# Altium project PCB_Project_FlightModel_EPS.PrjPcb (part 3 of 4)

## Sheet 3_MCU_EPS.SchDoc: EPS MCU Main
size A3; DrawnBy: Sara V. Martínez; Engineer: Flight; DocumentNumber: 6; Revision: V0.1; SheetNumber: 6; SheetTotal: 11
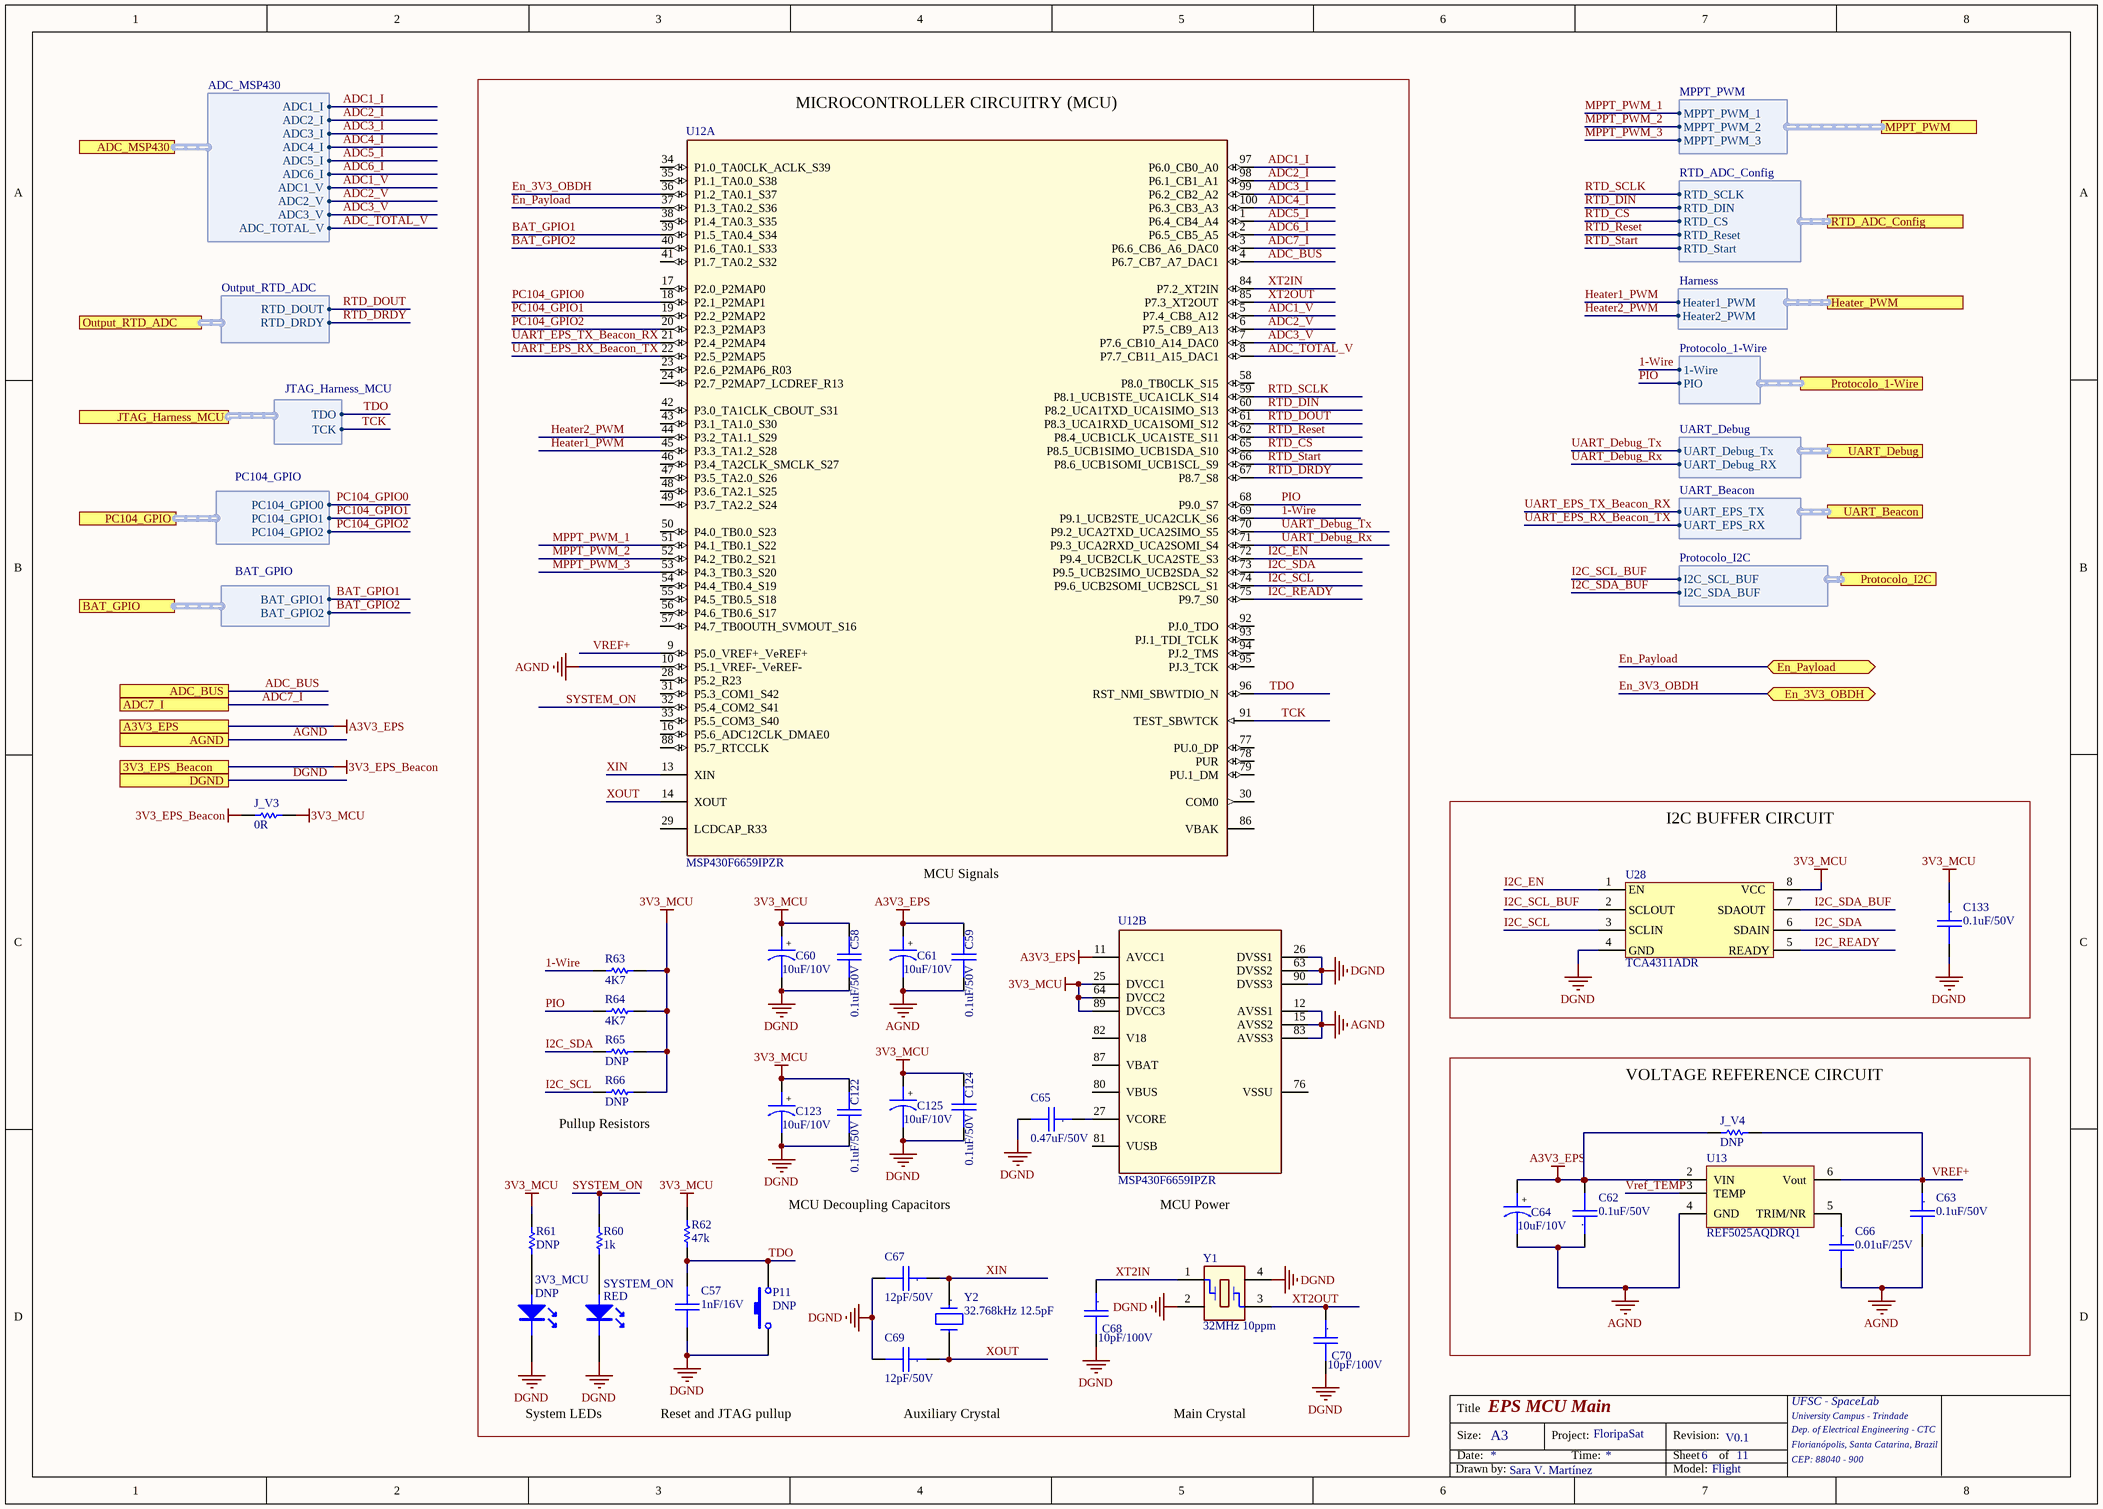
[diagram p4: 3_MCU_EPS.SchDoc]

### Parts
3V3_MCU  DNP  [0603-LED]
C57  1nF/16V  [CC0805]
C58  0.1uF/50V  [CC0603]
C59  0.1uF/50V  [CC0603]
C60  10uF/10V  [CC0805_Tantalum]
C61  10uF/10V  [CC0805_Tantalum]
C62  0.1uF/50V  [CC0805]
C63  0.1uF/50V  [CC0603]
C64  10uF/10V  [CC0805_Tantalum]
C65  0.47uF/50V  [CC0603]
C66  0.01uF/25V  [CC0603]
C67  12pF/50V  [CC0603]
C68  10pF/100V  [CC0805]
C69  12pF/50V  [CC0603]
C70  10pF/100V  [CC0805]
C122  0.1uF/50V  [CC0603]
C123  10uF/10V  [CC0805_Tantalum]
C124  0.1uF/50V  [CC0603]
C125  10uF/10V  [CC0805_Tantalum]
C133  0.1uF/50V  [CC0603]
J_V3  0R  [0805]
J_V4  DNP  [0805]
P11  DNP  [B3U-1000P]
R60  1k  [0603]
R61  DNP  [0603]
R62  47k  [0603]
R63  4K7  [0603]
R64  4K7  [0603]
R65  DNP  [0603]
R66  DNP  [0603]
SYSTEM_ON  RED  [0603-LED]
U12  MSP430F6659IPZR  [PZ0100A_N]  (parts A,B of 2)
U13  REF5025AQDRQ1  [SOIC-8]
U28  TCA4311ADR  [SOIC8]
Y1  32MHz 10ppm  [XTAL_ABM8X]
Y2  32.768kHz 12.5pF  [ABS06 0805]

### Blocks framed on the sheet
MICROCONTROLLER CIRCUITRY (MCU): 3V3_MCU C57-C61 C65 C67-C70 C122-C125 P11 R60-R66 SYSTEM_ON U12 Y1 Y2
I2C BUFFER CIRCUIT: C133 U28
VOLTAGE REFERENCE CIRCUIT: C62-C64 C66 J_V4 U13

### Ports
3V3_EPS_Beacon, A3V3_EPS, ADC7_I, ADC_BUS, ADC_MSP430 (harness ADC_MSP430), AGND, BAT_GPIO (harness BAT_GPIO), DGND, En_3V3_OBDH (bidir), En_Payload (bidir), Heater_PWM (harness Harness), JTAG_Harness_MCU (harness JTAG_Harness_MCU), MPPT_PWM (harness MPPT_PWM), Output_RTD_ADC (harness Output_RTD_ADC), PC104_GPIO (harness PC104_GPIO), Protocolo_1-Wire (harness Protocolo_1-Wire), Protocolo_I2C (harness Protocolo_I2C), RTD_ADC_Config (harness RTD_ADC_Config), UART_Beacon (harness UART_Beacon), UART_Debug (harness UART_Debug)

### Harnesses
ADC_MSP430: ADC1_I, ADC2_I, ADC3_I, ADC1_V, ADC2_V, ADC3_V, ADC_TOTAL_V, ADC4_I, ADC5_I, ADC6_I
MPPT_PWM: MPPT_PWM_1, MPPT_PWM_2, MPPT_PWM_3
Protocolo_1-Wire: 1-Wire, PIO
Output_RTD_ADC: RTD_DOUT, RTD_DRDY
RTD_ADC_Config: RTD_SCLK, RTD_DIN, RTD_CS, RTD_Reset, RTD_Start
JTAG_Harness_MCU: TDO, TCK
UART_Debug: UART_Debug_Tx, UART_Debug_RX
Protocolo_I2C: I2C_SCL_BUF, I2C_SDA_BUF
Harness: Heater1_PWM, Heater2_PWM
UART_Beacon: UART_EPS_TX, UART_EPS_RX
PC104_GPIO: PC104_GPIO0, PC104_GPIO1, PC104_GPIO2
BAT_GPIO: BAT_GPIO1, BAT_GPIO2

### Nets
3V3_EPS_Beacon: J_V3.2 ; port 3V3_EPS_Beacon
3V3_MCU: C58.1 C60.1 C122.1 C123.1 C124.1 C125.1 C133.1 J_V3.1 R61.2 R62.2 R63.1 R64.1 R65.1 R66.1 U12.25(DVCC1) U12.64(DVCC2) U12.89(DVCC3) U28.8(VCC)
A3V3_EPS: C59.1 C61.1 C62.2 C64.1 J_V4.2 U12.11(AVCC1) U13.2(VIN) ; port A3V3_EPS
AGND: C59.2 C61.2 C62.1 C63.2 C64.2 C66.2 U12.10(P5.1_VREF-_VeREF-) U12.12(AVSS1) U12.15(AVSS2) U12.83(AVSS3) U13.4(GND) ; port AGND
DGND: 3V3_MCU.2(K) C57.2 C58.2 C60.2 C65.2 C67.2 C68.2 C69.2 C70.2 C122.2 C123.2 C124.2 C125.2 C133.2 P11.1 SYSTEM_ON.2(K) U12.26(DVSS1) U12.63(DVSS2) U12.90(DVSS3) U28.4(GND) Y1.2 Y1.4 ; port DGND
1-Wire: R63.2 U12.69(P9.1_UCB2STE_UCA2CLK_S6) ; port Protocolo_1-Wire.1-Wire
ADC1_I: U12.97(P6.0_CB0_A0) ; port ADC_MSP430.ADC1_I
ADC1_V: U12.5(P7.4_CB8_A12) ; port ADC_MSP430.ADC1_V
ADC2_I: U12.98(P6.1_CB1_A1) ; port ADC_MSP430.ADC2_I
ADC2_V: U12.6(P7.5_CB9_A13) ; port ADC_MSP430.ADC2_V
ADC3_I: U12.99(P6.2_CB2_A2) ; port ADC_MSP430.ADC3_I
ADC3_V: U12.7(P7.6_CB10_A14_DAC0) ; port ADC_MSP430.ADC3_V
ADC4_I: U12.100(P6.3_CB3_A3) ; port ADC_MSP430.ADC4_I
ADC5_I: U12.1(P6.4_CB4_A4) ; port ADC_MSP430.ADC5_I
ADC6_I: U12.2(P6.5_CB5_A5) ; port ADC_MSP430.ADC6_I
ADC7_I: U12.3(P6.6_CB6_A6_DAC0) ; port ADC7_I
ADC_BUS: U12.4(P6.7_CB7_A7_DAC1) ; port ADC_BUS
ADC_TOTAL_V: U12.8(P7.7_CB11_A15_DAC1) ; port ADC_MSP430.ADC_TOTAL_V
BAT_GPIO1: U12.39(P1.5_TA0.4_S34) ; port BAT_GPIO.BAT_GPIO1
BAT_GPIO2: U12.40(P1.6_TA0.1_S33) ; port BAT_GPIO.BAT_GPIO2
En_3V3_OBDH: U12.36(P1.2_TA0.1_S37) ; port En_3V3_OBDH
En_Payload: U12.37(P1.3_TA0.2_S36) ; port En_Payload
Heater1_PWM: U12.45(P3.3_TA1.2_S28) ; port Heater_PWM.Heater1_PWM
Heater2_PWM: U12.44(P3.2_TA1.1_S29) ; port Heater_PWM.Heater2_PWM
I2C_EN: U12.72(P9.4_UCB2CLK_UCA2STE_S3) U28.1(EN)
I2C_READY: U12.75(P9.7_S0) U28.5(READY)
I2C_SCL: R66.2 U12.74(P9.6_UCB2SOMI_UCB2SCL_S1) U28.3(SCLIN)
I2C_SCL_BUF: U28.2(SCLOUT) ; port Protocolo_I2C.I2C_SCL_BUF
I2C_SDA: R65.2 U12.73(P9.5_UCB2SIMO_UCB2SDA_S2) U28.6(SDAIN)
I2C_SDA_BUF: U28.7(SDAOUT) ; port Protocolo_I2C.I2C_SDA_BUF
MPPT_PWM_1: U12.51(P4.1_TB0.1_S22) ; port MPPT_PWM.MPPT_PWM_1
MPPT_PWM_2: U12.52(P4.2_TB0.2_S21) ; port MPPT_PWM.MPPT_PWM_2
MPPT_PWM_3: U12.53(P4.3_TB0.3_S20) ; port MPPT_PWM.MPPT_PWM_3
PC104_GPIO0: U12.18(P2.1_P2MAP1) ; port PC104_GPIO.PC104_GPIO0
PC104_GPIO1: U12.19(P2.2_P2MAP2) ; port PC104_GPIO.PC104_GPIO1
PC104_GPIO2: U12.20(P2.3_P2MAP3) ; port PC104_GPIO.PC104_GPIO2
PIO: R64.2 U12.68(P9.0_S7) ; port Protocolo_1-Wire.PIO
RTD_CS: U12.65(P8.5_UCB1SIMO_UCB1SDA_S10) ; port RTD_ADC_Config.RTD_CS
RTD_DIN: U12.60(P8.2_UCA1TXD_UCA1SIMO_S13) ; port RTD_ADC_Config.RTD_DIN
RTD_DOUT: U12.61(P8.3_UCA1RXD_UCA1SOMI_S12) ; port Output_RTD_ADC.RTD_DOUT
RTD_DRDY: U12.67(P8.7_S8) ; port Output_RTD_ADC.RTD_DRDY
RTD_Reset: U12.62(P8.4_UCB1CLK_UCA1STE_S11) ; port RTD_ADC_Config.RTD_Reset
RTD_SCLK: U12.59(P8.1_UCB1STE_UCA1CLK_S14) ; port RTD_ADC_Config.RTD_SCLK
RTD_Start: U12.66(P8.6_UCB1SOMI_UCB1SCL_S9) ; port RTD_ADC_Config.RTD_Start
SYSTEM_ON: R60.2 U12.32(P5.4_COM2_S41)
TCK: U12.91(TEST_SBWTCK) ; port JTAG_Harness_MCU.TCK
TDO: C57.1 P11.2 R62.1 U12.96(RST_NMI_SBWTDIO_N) ; port JTAG_Harness_MCU.TDO
UART_Debug_Rx: U12.71(P9.3_UCA2RXD_UCA2SOMI_S4) ; port UART_Debug.UART_Debug_RX
UART_Debug_Tx: U12.70(P9.2_UCA2TXD_UCA2SIMO_S5) ; port UART_Debug.UART_Debug_Tx
UART_EPS_RX_Beacon_TX: U12.22(P2.5_P2MAP5) ; port UART_Beacon.UART_EPS_RX
UART_EPS_TX_Beacon_RX: U12.21(P2.4_P2MAP4) ; port UART_Beacon.UART_EPS_TX
VREF+: C63.1 J_V4.1 U12.9(P5.0_VREF+_VeREF+) U13.6(Vout)
Vref_TEMP: U13.3(TEMP)
XIN: C67.1 U12.13(XIN) Y2.1
XOUT: C69.1 U12.14(XOUT) Y2.2
XT2IN: C68.1 U12.84(P7.2_XT2IN) Y1.1
XT2OUT: C70.1 U12.85(P7.3_XT2OUT) Y1.3
Net3V3_MCU_1: 3V3_MCU.1(A) R61.1
NetC65_1: C65.1 U12.27(VCORE)
NetC66_1: C66.1 U13.5(TRIM/NR)
NetR60_1: R60.1 SYSTEM_ON.1(A)

Not connected (* = marked no-connect by the designer): U12 16(P5.6_ADC12CLK_DMAE0) 17(P2.0_P2MAP0) 23(P2.6_P2MAP6_R03) 24(P2.7_P2MAP7_LCDREF_R13) 28(P5.2_R23) 29(LCDCAP_R33) 30(COM0) 31(P5.3_COM1_S42) 33(P5.5_COM3_S40) 34(P1.0_TA0CLK_ACLK_S39) 35(P1.1_TA0.0_S38) 38(P1.4_TA0.3_S35) 41(P1.7_TA0.2_S32) 42(P3.0_TA1CLK_CBOUT_S31) 43(P3.1_TA1.0_S30) 46(P3.4_TA2CLK_SMCLK_S27) 47(P3.5_TA2.0_S26) 48(P3.6_TA2.1_S25) 49(P3.7_TA2.2_S24) 50(P4.0_TB0.0_S23) 54(P4.4_TB0.4_S19) 55(P4.5_TB0.5_S18) 56(P4.6_TB0.6_S17) 57(P4.7_TB0OUTH_SVMOUT_S16) 58(P8.0_TB0CLK_S15) 76(VSSU) 77(PU.0_DP) 78(PUR) 79(PU.1_DM) 80(VBUS) 81(VUSB) 82(V18) 86(VBAK) 87(VBAT) 88(P5.7_RTCCLK) 92(PJ.0_TDO) 93(PJ.1_TDI_TCLK) 94(PJ.2_TMS) 95(PJ.3_TCK)

### Notes on the sheet
- MCU Signals
- (near R66) Pullup Resistors
- MCU Decoupling Capacitors
- MCU Power
- System LEDs
- Reset and JTAG pullup
- Auxiliary Crystal
- Main Crystal
- Title
- Size:
- Date:
- A3
- Project:
- Time:
- FloripaSat
- Revision:
- Sheet
- of
- UFSC - SpaceLab
- University Campus - Trindade
- Dep. of Electrical Engineering - CTC
- Florianópolis, Santa Catarina, Brazil
- CEP: 88040 - 900
- Drawn by:
- Model:
- (in symbol Cap_Cer_X7R_0.01uF_25V_0603) .
- (in symbol Cap_Cer_X7R_0.1uF_25V_0805) .
- (in symbol Cap_Cer_X7R_0.1uF_50V_0603) .
- (in symbol Cap_Cer_X7R_0.47uF_50V_0603) .
- (in symbol Cap_Cer_X7R_1nF_16V_0603) .
- (in symbol Cap_Cer_X7R_10pF_100V_0805) .
- (in symbol Cap_Cer_X7R_12pF_50V_0603) .
- (in symbol Cap_Tant_SMD_10uF_6V3_0805) +
- (in symbol Xtal_32.768kHz_12pF_2_SMD) .

### Library data of the parts
3V3_MCU = LED/G_0603: SMD Green LED; Partnumber: 150060VS75000; NCM: 8541.40.21
C57 = Cap_Cer_X7R_1nF_16V_0603: CAP CER 1nF 16V 0603 5%; Partnumber: C0603X102J4RECAUTO; NCM: 8532.24.10
C58 C59 C63 C122 C124 C133 = Cap_Cer_X7R_0.1uF_50V_0603: CAP CER 0.1UF 50V 10% X7R 0603; Partnumber: CC0603KPX7R9BB104
C60 C61 C64 C123 C125 = Cap_Tant_SMD_10uF_6V3_0805: CAP Tantalum 10uF 6.3V 10% 0805; Partnumber: TPSR106K006R1000; NCM: 8532.21.11
C62 = Cap_Cer_X7R_0.1uF_25V_0805: CAP CER 0.1UF 50V 10% X7R 0805; Partnumber: GRM188R71H104KA93D; NCM: 8532.24.10
C65 = Cap_Cer_X7R_0.47uF_50V_0603: CAP CER 0.47UF 50V 10% X7R 0603; Partnumber: C1608X7R1H474K080AE; NCM: 8532.24.10
C66 = Cap_Cer_X7R_0.01uF_25V_0603: CAP CER 0.01UF 25V 5% X7R 0603; Partnumber: 06033C103JAT4A; NCM: 8532.24.10
C67 C69 = Cap_Cer_X7R_12pF_50V_0603: CAP CER 12pF 50V 0603; Partnumber: GQM1885C1H120GB01D; NCM: 8532.24.10
C68 C70 = Cap_Cer_X7R_10pF_100V_0805: CAP CER 10pF 100V 0805; Partnumber: 08051A100FAT2A; NCM: 8532.24.10
J_V3 J_V4 = R0R_JUMPER_1/8W_0805: RES 0R OHM 1/8W JUMPER 0805; Partnumber: CRCW08050000Z0EA
P11 = Tactile_Switches_B3U-1000P: Tactile Switch SPST-NO Top Actuated Surface Mount 12V 0.05A; Manufacturer: TE Connectivity; Partnumber: B3U-1000P
R60 R61 = R1.0k_1%_1/8W_0603: RES 1.0K OHM 1/8W 1% 0603; Partnumber: MCT06030C1001FP500; NCM: 8533.21.20
R62 = R47k_1%_1/8W_0603: RES 47K OHM 1/8W 0.5% 0603; Partnumber: MCT0603MD4702DP500; NCM: 8533.21.20
R63 R64 = R4.7K_1%_1/8W_0603: RES 4K7 OHM 1/8W 1% 0603; Partnumber: MCT06030C4701FP500; NCM: 8533.21.20
R65 R66 = R10k_1%_1/8W_0603: RES 10K OHM 1/8W 1%  0603; Partnumber: MCT0603MC1002FP500; NCM: 8533.21.20
SYSTEM_ON = LED/R_0603: SMD Red LED; Partnumber: LTST-C191KFKT; NCM: 8541.40.21
U12 = MSP430F6659IPZR: Imported; Manufacturer: Texas Instruments; CompType: IC; PIN_COUNT: 100; Application_BuildNumber: *; PartNumber: MSP430F6659IPZR; Alternate PartNumber: MSP430F6659IPZ; PackageReference: PZ0100A; MountType: SMT; RoHS: Y; RefDes: RefDes; Type: DEV; Value: Value
U13 = REF5025A-Q1: Partnumber: REF5025AQDRQ1
U28 = TCA4311ADR: IC SIGNAL BUFFER I2C 8SOIC; Partnumber: TCA4311ADR
Y1 = XTAL_32MHz_SMD_4-SMD: 32MHz ±10ppm Crystal 10pF 60 Ohm -40°C ~ 125°C; Partnumber: ABM8X-102-32.000MHZ-T; NCM: 8541.60.10
Y2 = Xtal_32.768kHz_12pF_2_SMD: 32.768kHz ±20ppm Crystal 12.5pF 70 kOhm -40°C ~ 125°C; Partnumber: ECS-.327-12.5-34S-TR; NCM: 8541.60.10

## Sheet 6_dc_dc_5V_Payloads.SchDoc: Payloads Step-Down Converters 5V/3A
size A4; DrawnBy: Sara V. Martínez; Engineer: Flight; DocumentNumber: 9; Revision: V0.1; SheetNumber: 9; SheetTotal: 11
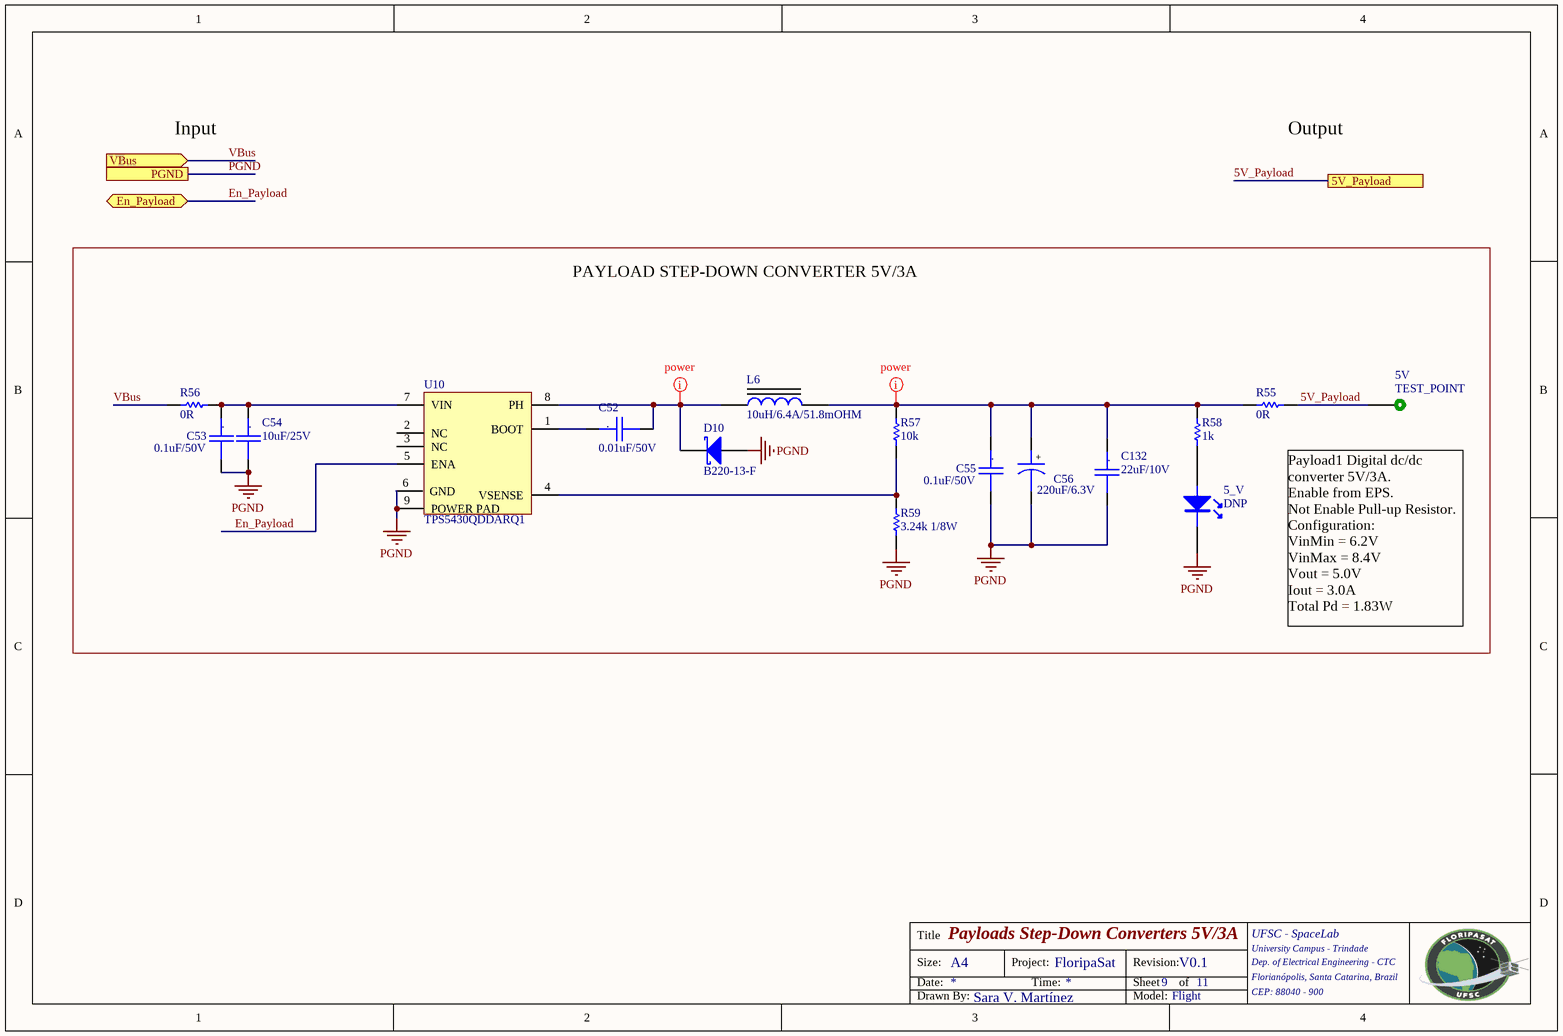
[diagram p5: 6_dc_dc_5V_Payloads.SchDoc]

### Parts
5_V  DNP  [0603-LED]
5V  TEST_POINT  [TEST_POINT]  (no BOM)
C52  0.01uF/50V  [CC0805]
C53  0.1uF/50V  [CC0805]
C54  10uF/25V  [CC1206]
C55  0.1uF/50V  [CC0805]
C56  220uF/6.3V  [cc1210]
C132  22uF/10V  [CC1206]
D10  B220-13-F  [DO-214AA]
L6  10uH/6.4A/51.8mOHM  [Ind_IHLP]
R55  0R  [1206]
R56  0R  [1206]
R57  10k  [0805]
R58  1k  [0603]
R59  3.24k 1/8W  [0805]
U10  TPS5430QDDARQ1  [SO8 Power PAD]

### Blocks framed on the sheet
PAYLOAD STEP-DOWN CONVERTER 5V/3A: 5_V 5V C52-C56 C132 D10 L6 R55-R59 U10

### Ports
5V_Payload, En_Payload (bidir), PGND, VBus (in)

### Nets
PGND: 5_V.2(K) C53.2 C54.2 C55.2 C56.2 C132.2 D10.2(A) R59.1 U10.6(GND) U10.9(POWER_PAD) ; port PGND
5V_Payload: 5V.1 R55.1 ; port 5V_Payload
En_Payload: U10.5(ENA) ; port En_Payload
VBus: R56.2 ; port VBus
Net5_V_1: 5_V.1(A) R58.2
NetC52_1: C52.1 U10.1(BOOT)
NetC52_2: C52.2 D10.1(K) L6.1 U10.8(PH)
NetC53_1: C53.1 C54.1 R56.1 U10.7(VIN)
NetC55_1: C55.1 C56.1 C132.1 L6.2 R55.2 R57.2 R58.1
NetR57_1: R57.1 R59.2 U10.4(VSENSE)

Not connected (* = marked no-connect by the designer): U10 2(NC) 3(NC)

### Layout directives
net class power: NetC52_2, NetC55_1

### Notes on the sheet
- Input
- Output
- Payload1 Digital dc/dc converter 5V/3A.
  Enable from EPS.
  Not Enable Pull-up Resistor.
  Configuration:
  VinMin = 6.2V
  VinMax = 8.4V
  Vout = 5.0V
  Iout = 3.0A
  Total Pd = 1.83W
- Title
- Size:
- Date:
- A4
- Project:
- Time:
- FloripaSat
- Revision:
- Sheet
- of
- UFSC - SpaceLab
- University Campus - Trindade
- Dep. of Electrical Engineering - CTC
- Florianópolis, Santa Catarina, Brazil
- Drawn By:
- Model:
- CEP: 88040 - 900
- (in symbol Cap_Cer_X7R_0.01uF_50V_0805) .
- (in symbol Cap_Cer_X7R_0.1uF_50V_0805) .
- (in symbol Cap_Cer_X7R_10uF_25V_1206) .
- (in symbol Cap_Cer_X7R_22uF_10V_1206) .
- (in symbol Cap_Tant_SMD_220uF_6.3V_1210) +

### Library data of the parts
5_V = LED/G_0603: SMD Green LED; Partnumber: 150060VS75000; Manufacturer: Wurth Electronics; Dominant Wavelength: 570nm; Forward Current: 30mA; Forward Voltage: 2V; Lens Style: Clear,Rectangular; Luminous Intensity: 40mcd; Test Current: 20mA; Viewing Angle: 140°; NCM: 8541.40.21; Case/Package: 0603; Case Code (Imperial): 0603; Case Code (Metric): 1608; Color: Green; ComponentLink1Description: https://katalog.we-online.de/led/datasheet/150060VS75000.pdf?src-supplier=Digi-Key; ComponentLink1URL: https://katalog.we-online.de/led/datasheet/150060VS75000.pdf?src-supplier=Digi-Key; Height: 0.7mm; Length: 1.6mm; Manufacturer Part Number: 150060VS75000; Max Operating Temperature: 85°C; Min Operating Temperature: -40°C; Mount: Surface Mount; Number of Pins: 2; Package Quantity: 1; Packaging: Tape and Reel; Pricing 1: 1=0.14, 10=0.138, 25=0.138, 50=0.129, 100=0.11, 250=0.11 (USD); Pricing 2: 1=0.14, 50=0.133, 100=0.114, 500=0.099 (USD); REACH SVHC: Unknown; Stock 1: 16336; Stock 2: 31910; Supplier 1: Mouser; Supplier 2: Digi-Key; Supplier Part Number 1: 710-150060VS75000; Supplier Part Number 2: 732-4980-1-ND; Wavelength: 570nm; Width: 0.8mm
5V = TEST_POINT: Test point
C52 = Cap_Cer_X7R_0.01uF_50V_0805: CAP CER 0.01uF 50V 10% X7R 0805; Partnumber: 08055C103KAT4A; Manufacturer: Kyocera AVX; Capacitance: 10nF; NCM: 8532.24.10; Case/Package: 0805; Case Code (Imperial): 0805; Case Code (Metric): 2012; ComponentLink1Description: http://www.mouser.com/ds/2/40/X7RDielectric-777024.pdf?src-supplier=Mouser; ComponentLink1URL: http://www.mouser.com/ds/2/40/X7RDielectric-777024.pdf?src-supplier=Mouser; ComponentLink2Description: http://www.avx.com/docs/Catalogs/cx7r.pdf?src-supplier=Future+Electronics; ComponentLink2URL: http://www.avx.com/docs/Catalogs/cx7r.pdf?src-supplier=Future+Electronics; Depth: 1.25mm; Dielectric: X7R; Height: 0.94mm; Lead Free: Lead Free; Length: 2.01mm; Manufacturer Part Number: 08055C103KAT4A; Max Operating Temperature: 125°C; Min Operating Temperature: -55°C; Mount: Surface Mount; Number of Pins: 2; Packaging: Tape and Reel; Pricing 1: 1=0.12, 10=0.085, 100=0.04, 500=0.028, 1000=0.023, 2500=0.018 (USD); Pricing 2: 1=0.13, 10=0.09, 50=0.0508, 100=0.0421, 500=0.02952, 1000=0.02444, 2500=0.02275, 5000=0.02081 (USD); Radiation Hardening: No; Stock 1: 88198; Stock 2: 515319; Supplier 1: Mouser; Supplier 2: Digi-Key; Supplier Part Number 1: 581-08055C103KAT4A; Supplier Part Number 2: 478-10687-1-ND; Termination: SMD/SMT; Tolerance: 10%; Voltage: 50V; Voltage Rating (DC): 50V; Voltage Rating: 50V; Weight: 0.000194oz; Width: 1.25mm
C53 C55 = Cap_Cer_X7R_0.1uF_50V_0805: CAP CER 0.1UF 50V 10% X7R 0805; Partnumber: CC0805KRX7R9BB104; Manufacturer: Yageo; Capacitance: 100nF; Insulation Resistance: 100GR; Material: Ceramic; Case/Package: 0805; Case Code (Imperial): 0805; Case Code (Metric): 2012; ComponentLink1Description: http://www.yageo.com/documents/recent/UPY-GPHC_X7R_6.3V-to-50V_8.pdf?src-supplier=Avnet; ComponentLink1URL: http://www.yageo.com/documents/recent/UPY-GPHC_X7R_6.3V-to-50V_8.pdf?src-supplier=Avnet; ComponentLink2Description: http://www.farnell.com/datasheets/1489800.pdf?src-supplier=Element14; ComponentLink2URL: http://www.farnell.com/datasheets/1489800.pdf?src-supplier=Element14; ComponentLink3Description: http://www.yageo.com/documents/recent/UPY-GPHC_X7R_6.3V-to-50V_18.pdf?src-supplier=Digi-Key; ComponentLink3URL: http://www.yageo.com/documents/recent/UPY-GPHC_X7R_6.3V-to-50V_18.pdf?src-supplier=Digi-Key; ComponentLink4Description: http://www.farnell.com/datasheets/2167236.pdf?src-supplier=Element14; ComponentLink4URL: http://www.farnell.com/datasheets/2167236.pdf?src-supplier=Element14; ComponentLink5Description: http://www.yageo.com/documents/recent/UPY-GPHC_X7R_6.3V-to-50V_8.pdf?src-supplier=Avnet+Europe; ComponentLink5URL: http://www.yageo.com/documents/recent/UPY-GPHC_X7R_6.3V-to-50V_8.pdf?src-supplier=Avnet+Europe; ComponentLink6Description: http://www.produktinfo.conrad.com/datenblaetter/425000-449999/445210-da-01-en-KERKO_CHIP_0805_X7R_0_1uF_10Proz_50VG.pdf?src-supplier=Conrad; ComponentLink6URL: http://www.produktinfo.conrad.com/datenblaetter/425000-449999/445210-da-01-en-KERKO_CHIP_0805_X7R_0_1uF_10Proz_50VG.pdf?src-supplier=Conrad; Depth: 1.25mm; Dielectric: X7R; Halogen Free: Halogen Free; Height: 0.85mm; Lead Free: Lead Free; Length: 2mm; Manufacturer Part Number: CC0805KRX7R9BB104; Max Operating Temperature: 125°C; Min Operating Temperature: -55°C; Mount: Surface Mount; Number of Pins: 2; Package Quantity: 1; Packaging: Tape and Reel; Pricing 1: 1=0.12, 10=0.087, 100=0.028, 1000=0.023, 4000=0.018, 8000=0.017 (USD); Pricing 2: 1=0.12, 10=0.088, 50=0.05, 100=0.0414, 500=0.02906, 1000=0.02405 (USD); Radiation Hardening: No; REACH SVHC: No SVHC; Stock 1: 3904445; Stock 2: 544494; Supplier 1: Mouser; Supplier 2: Digi-Key; Supplier Part Number 1: 603-CC805KRX7R9BB104; Supplier Part Number 2: 311-1140-1-ND; Termination: SMD/SMT; Thickness: 0.033inch; Tolerance: 10%; Voltage: 50V; Voltage Rating: 50V; Width: 0.049inch
C54 = Cap_Cer_X7R_10uF_25V_1206: CAP CER 10uF 25V 10% X7R 1206; Partnumber: GRM31CR71E106KA12L; Manufacturer: Murata; Material: Ceramic; NCM: 8532.24.10; Capacitance: 10uF; Case/Package: 1206; Case Code (Imperial): 1206; Case Code (Metric): 3216; ComponentLink1Description: http://www.mouser.com/ds/2/281/c02e-2905.pdf?src-supplier=Mouser; ComponentLink1URL: http://www.mouser.com/ds/2/281/c02e-2905.pdf?src-supplier=Mouser; ComponentLink2Description: http://www.farnell.com/datasheets/415311.pdf?src-supplier=Element14; ComponentLink2URL: http://www.farnell.com/datasheets/415311.pdf?src-supplier=Element14; ComponentLink3Description: http://www.farnell.com/datasheets/2048746.pdf?src-supplier=Element14; ComponentLink3URL: http://www.farnell.com/datasheets/2048746.pdf?src-supplier=Element14; ComponentLink4Description: http://uk.rs-online.com/webdocs/13d2/0900766b813d2ca8.pdf?src-supplier=RSComponents; ComponentLink4URL: http://uk.rs-online.com/webdocs/13d2/0900766b813d2ca8.pdf?src-supplier=RSComponents; ComponentLink5Description: http://search.murata.co.jp/Ceramy/image/img/A01X/partnumbering_e_01.pdf?src-supplier=Future+Electronics; ComponentLink5URL: http://search.murata.co.jp/Ceramy/image/img/A01X/partnumbering_e_01.pdf?src-supplier=Future+Electronics; ComponentLink6Description: https://www.distrelec.biz/Web/Downloads/_t/ds/murata_MLCC_eng_tds.pdf?mime=application%2Fpdf&src-supplier=Distrelec; ComponentLink6URL: https://www.distrelec.biz/Web/Downloads/_t/ds/murata_MLCC_eng_tds.pdf?mime=application%2Fpdf&src-supplier=Distrelec; ComponentLink7Description: https://www.murata.com/~/media/webrenewal/support/library/catalog/products/capacitor/mlcc/c02e.ashx?la=en-us&src-supplier=Digi-Key; ComponentLink7URL: https://www.murata.com/~/media/webrenewal/support/library/catalog/products/capacitor/mlcc/c02e.ashx?la=en-us&src-supplier=Digi-Key; ComponentLink8Description: http://components.arrow.com/part/dataview/46271255S8319800N2606?src-supplier=Arrow; ComponentLink8URL: http://components.arrow.com/part/dataview/46271255S8319800N2606?src-supplier=Arrow; ComponentLink9Description: http://www.farnell.com/datasheets/415311.pdf?src-supplier=Farnell; ComponentLink9URL: http://www.farnell.com/datasheets/415311.pdf?src-supplier=Farnell; ComponentLink10Description: http://www.produktinfo.conrad.com/datenblaetter/450000-474999/454935-da-01-en-VS_KONDENSATOR_1206.pdf?src-supplier=Conrad; ComponentLink10URL: http://www.produktinfo.conrad.com/datenblaetter/450000-474999/454935-da-01-en-VS_KONDENSATOR_1206.pdf?src-supplier=Conrad; ComponentLink11Description: http://www.produktinfo.conrad.com/datenblaetter/450000-474999/451104-da-01-de-VS_CHIP_KOND_1206_10_0_UF_10Pr_25_0V_X7R.pdf?src-supplier=Conrad; ComponentLink11URL: http://www.produktinfo.conrad.com/datenblaetter/450000-474999/451104-da-01-de-VS_CHIP_KOND_1206_10_0_UF_10Pr_25_0V_X7R.pdf?src-supplier=Conrad; Depth: 1.6mm; Dielectric: X7R; Height: 1.6mm; Lead Free: Lead Free; Length: 3.2mm; Manufacturer Part Number: GRM31CR71E106KA12L; Max Operating Temperature: 125°C; Min Operating Temperature: -55°C; Mount: Surface Mount; Number of Pins: 2; Package Quantity: 1; Packaging: Tape and Reel; Pricing 1: 1=0.83, 10=0.627, 100=0.448, 250=0.434, 500=0.347, 1000=0.299 (USD); Pricing 2: 1=0.88, 10=0.646, 50=0.517, 100=0.4431, 500=0.35082, 1000=0.29543 (USD); Radiation Hardening: No; REACH SVHC: No SVHC; Stock 1: 131052; Stock 2: 1515422; Supplier 1: Mouser; Supplier 2: Digi-Key; Supplier Part Number 1: 81-GRM31CR71E106KA12; Supplier Part Number 2: 490-6518-1-ND; Termination: SMD/SMT; Thickness: 0.071inch; Tolerance: 10%; Voltage: 25V; Voltage Rating (DC): 25V; Voltage Rating: 25V; Width: 1.6mm
C56 = Cap_Tant_SMD_220uF_6.3V_1210: CAP Tantalum 220uF 6.3V 20% 1210; Partnumber: 6TPE220MAZB; Manufacturer: Panasonic; Dissipation Factor: 10%; ESR (Equivalent Series Resistance): 35mR; Leakage Current: 138.6uA; Polarity: Polar; Ripple Current: 1.4A; NCM: 8532.21.11; Capacitance: 220uF; Case/Package: Molded; Case Code (Imperial): 1411; Case Code (Metric): 3528; ComponentLink1Description: http://www.farnell.com/datasheets/2059638.pdf?src-supplier=Element14; ComponentLink1URL: http://www.farnell.com/datasheets/2059638.pdf?src-supplier=Element14; ComponentLink2Description: https://www.verical.com/server-webapp/html/getDatasheet?partID=733772&src-supplier=Verical; ComponentLink2URL: https://www.verical.com/server-webapp/html/getDatasheet?partID=733772&src-supplier=Verical; ComponentLink3Description: https://www.distrelec.biz/Web/Downloads/_t/ds/tpe-series_eng_tds.pdf?mime=application%2Fpdf&src-supplier=Distrelec; ComponentLink3URL: https://www.distrelec.biz/Web/Downloads/_t/ds/tpe-series_eng_tds.pdf?mime=application%2Fpdf&src-supplier=Distrelec; ComponentLink4Description: http://industrial.panasonic.com/www-data/pdf/AAA8000/AAA8000CE5.pdf?src-supplier=Avnet; ComponentLink4URL: http://industrial.panasonic.com/www-data/pdf/AAA8000/AAA8000CE5.pdf?src-supplier=Avnet; ComponentLink5Description: http://www.mouser.com/ds/2/315/AAA8000C36-947358.pdf?src-supplier=Mouser; ComponentLink5URL: http://www.mouser.com/ds/2/315/AAA8000C36-947358.pdf?src-supplier=Mouser; Depth: 2.8mm; Features: General Purpose; Height - Seated (Max): 0.079inch; Height: 1.9mm; Lead Free: Lead Free; Length: 3.5mm; Manufacturer Part Number: 6TPE220MAZB; Max Operating Temperature: 105°C; Min Operating Temperature: -55°C; Mount: Surface Mount; Number of Pins: 2; Package Quantity: 2000; Packaging: Tape and Reel; Pricing 1: 1=1.63, 10=1.28, 100=0.964, 500=0.728, 1000=0.642, 2000=0.521 (USD); Pricing 2: 1=1.56, 10=1.23, 50=1.0656, 100=0.9222, 500=0.69676, 1000=0.61479 (USD); Radiation Hardening: No; REACH SVHC: No SVHC; Stock 1: 11237; Stock 2: 59078; Supplier 1: Mouser; Supplier 2: Digi-Key; Supplier Part Number 1: 667-6TPE220MAZB; Supplier Part Number 2: P16245CT-ND; Termination: SMD/SMT; Tolerance: 20%; Voltage: 6.3V; Voltage Rating (DC): 6.3V; Voltage Rating: 6.3V; Width: 0.11inch
C132 = Cap_Cer_X7R_22uF_10V_1206: CAP CER 22uF 10V 10% X7R 1206; Partnumber: GRM31CR71A226KE15L; Manufacturer: Murata; Material: Ceramic; NCM: 8532.24.10; Capacitance: 22uF; Case/Package: 1206; Case Code (Imperial): 1206; Case Code (Metric): 3216; ComponentLink1Description: http://components.arrow.com/part/dataview/46868660S8337524N2606?src-supplier=Arrow; ComponentLink1URL: http://components.arrow.com/part/dataview/46868660S8337524N2606?src-supplier=Arrow; ComponentLink2Description: http://uk.rs-online.com/webdocs/1423/0900766b81423c84.pdf?src-supplier=RSComponents; ComponentLink2URL: http://uk.rs-online.com/webdocs/1423/0900766b81423c84.pdf?src-supplier=RSComponents; ComponentLink3Description: https://www.murata.com/~/media/webrenewal/support/library/catalog/products/capacitor/mlcc/c02e.ashx?la=en-us&src-supplier=Digi-Key; ComponentLink3URL: https://www.murata.com/~/media/webrenewal/support/library/catalog/products/capacitor/mlcc/c02e.ashx?la=en-us&src-supplier=Digi-Key; ComponentLink4Description: http://www.farnell.com/datasheets/2048963.pdf?src-supplier=Farnell; ComponentLink4URL: http://www.farnell.com/datasheets/2048963.pdf?src-supplier=Farnell; ComponentLink5Description: http://www.farnell.com/datasheets/2048963.pdf?src-supplier=Element14; ComponentLink5URL: http://www.farnell.com/datasheets/2048963.pdf?src-supplier=Element14; ComponentLink6Description: http://psearch.en.murata.com/capacitor/product/GRM31CR71A226KE15%23.pdf?src-supplier=Avnet; ComponentLink6URL: http://psearch.en.murata.com/capacitor/product/GRM31CR71A226KE15%23.pdf?src-supplier=Avnet; ComponentLink7Description: http://psearch.murata.com/capacitor/product/GRM31CR71A226KE15%23.pdf?src-supplier=Avnet; ComponentLink7URL: http://psearch.murata.com/capacitor/product/GRM31CR71A226KE15%23.pdf?src-supplier=Avnet; ComponentLink8Description: https://www.distrelec.biz/Web/Downloads/_t/ds/murata_MLCC_eng_tds.pdf?mime=application%2Fpdf&src-supplier=Distrelec; ComponentLink8URL: https://www.distrelec.biz/Web/Downloads/_t/ds/murata_MLCC_eng_tds.pdf?mime=application%2Fpdf&src-supplier=Distrelec; ComponentLink9Description: http://psearch.murata.com/capacitor/product/GRM31CR71A226KE15%23.pdf?src-supplier=Future+Electronics; ComponentLink9URL: http://psearch.murata.com/capacitor/product/GRM31CR71A226KE15%23.pdf?src-supplier=Future+Electronics; ComponentLink10Description: http://www.produktinfo.conrad.com/datenblaetter/450000-474999/451412-da-01-de-VS_KONDENS_GRM31_CR71A_226KE15L.pdf?src-supplier=Conrad; ComponentLink10URL: http://www.produktinfo.conrad.com/datenblaetter/450000-474999/451412-da-01-de-VS_KONDENS_GRM31_CR71A_226KE15L.pdf?src-supplier=Conrad; ComponentLink11Description: http://www.produktinfo.conrad.com/datenblaetter/450000-474999/451120-da-01-de-VS_CHIP_KOND_1206_22_0_UF_10Pr_10_0V_X7R.pdf?src-supplier=Conrad; ComponentLink11URL: http://www.produktinfo.conrad.com/datenblaetter/450000-474999/451120-da-01-de-VS_CHIP_KOND_1206_22_0_UF_10Pr_10_0V_X7R.pdf?src-supplier=Conrad; Depth: 1.6mm; Dielectric: X7R; Height: 1.6mm; Lead Free: Lead Free; Length: 3.2mm; Manufacturer Part Number: GRM31CR71A226KE15L; Max Operating Temperature: 125°C; Min Operating Temperature: -55°C; Mount: Surface Mount; Package Quantity: 1; Packaging: Tape and Reel; Pricing 1: 1=1.11, 10=0.921, 100=0.697, 250=0.677, 500=0.527, 1000=0.464 (USD); Pricing 2: 1=1.13, 10=0.889, 50=0.7702, 100=0.6666, 500=0.50362, 1000=0.44438 (USD); Radiation Hardening: No; REACH SVHC: No SVHC; Stock 1: 113879; Stock 2: 339340; Supplier 1: Mouser; Supplier 2: Digi-Key; Supplier Part Number 1: 81-GRM31CR71A226K15L; Supplier Part Number 2: 490-5309-1-ND; Termination: SMD/SMT; Thickness: 0.071inch; Tolerance: 10%; Voltage: 10V; Voltage Rating (DC): 10V; Voltage Rating: 10V; Width: 0.063inch
D10 = DIODE_SCHOTTKY_20V_2A_MB220-13-F: DIODE SCHOTTKY 20V 2A B220-13-F; Manufacturer: Diodes; Capacitance: 200pF; Element Configuration: Single; Forward Voltage: 500mV; Max Forward Surge Current (Ifsm): 50A; Peak Reverse Current: 500uA; Polarity: Standard; NCM: 8541.10.29; Partnumber: B220-13-F; Average Rectified Current: 2A; Case/Package: SMB; ComponentLink1Description: http://www.diodes.com/datasheets/ds13004.pdf?src-supplier=Future+Electronics; ComponentLink1URL: http://www.diodes.com/datasheets/ds13004.pdf?src-supplier=Future+Electronics; ComponentLink2Description: http://www.diodes.com/datasheets/ds13004.pdf?src-supplier=Avnet; ComponentLink2URL: http://www.diodes.com/datasheets/ds13004.pdf?src-supplier=Avnet; Contact Plating: Tin,Matte; Current Rating: 2A; Forward Current: 2A; Height: 2.62mm; Lead Free: Lead Free; Length: 4.57mm; Manufacturer Part Number: B220-13-F; Max Operating Temperature: 150°C; Max Repetitive Reverse Voltage (Vrrm): 20V; Max Reverse Voltage (DC): 20V; Min Operating Temperature: -65°C; Mount: Surface Mount; Number of Pins: 2; Output Current: 2A; Package Quantity: 3000; Packaging: Tape and Reel; Peak Non-Repetitive Surge Current: 50A; Pricing 1: 1=0.45, 10=0.289, 100=0.124, 1000=0.095, 3000=0.072, 9000=0.064 (USD); Pricing 2: 1=0.46, 10=0.339, 25=0.2968, 100=0.1612, 250=0.16036, 500=0.1315, 1000=0.09757 (USD); Radiation Hardening: No; REACH SVHC: No SVHC; Stock 1: 3454; Stock 2: 5768; Supplier 1: Mouser; Supplier 2: Digi-Key; Supplier Part Number 1: 621-B220-F; Supplier Part Number 2: B220-FDICT-ND; Termination: SMD/SMT; Voltage Rating (DC): 20V; Weight: 0.00328oz; Width: 3.94mm
L6 = IND_POWER_10uH_6.4A_51.8mR: INDUCTOR 2.2UH 6.4A SMD; Partnumber: IHLP3232DZER100M11; Manufacturer: Vishay Dale; Core Material: Ferrite; Current Rating: 5.4A; DC Resistance (DCR): 51.8mR; Inductance: 10uH; Inductance Tolerance: 20%; Self Resonant Frequency: 12MHz; Shielding: Shielded; Test Frequency: 100kHz; NCM: 8504.50.00; Case/Package: 3232; ComponentLink1Description: http://www.vishay.com/docs/34313/ihlp3232dz11.pdf?src-supplier=Avnet; ComponentLink1URL: http://www.vishay.com/docs/34313/ihlp3232dz11.pdf?src-supplier=Avnet; ComponentLink2Description: http://www.vishay.com/docs/34313/ihlp3232dz11.pdf?src-supplier=Digi-Key; ComponentLink2URL: http://www.vishay.com/docs/34313/ihlp3232dz11.pdf?src-supplier=Digi-Key; ComponentLink3Description: https://www.alliedelec.com/m/d/5924ead94cc8907f6647c63e8202e128.pdf?src-supplier=Allied+Electronics; ComponentLink3URL: https://www.alliedelec.com/m/d/5924ead94cc8907f6647c63e8202e128.pdf?src-supplier=Allied+Electronics; ComponentLink4Description: http://www.farnell.com/datasheets/2045896.pdf?src-supplier=Element14; ComponentLink4URL: http://www.farnell.com/datasheets/2045896.pdf?src-supplier=Element14; ComponentLink5Description: http://www.vishay.com/docs/34313/ihlp3232dz11.pdf?src-supplier=Element14; ComponentLink5URL: http://www.vishay.com/docs/34313/ihlp3232dz11.pdf?src-supplier=Element14; Contact Plating: Tin; Depth: 8.26mm; Height - Seated (Max): 0.157inch; Height: 4mm; Lead Free: Lead Free; Length: 8.89mm; Manufacturer Part Number: IHLP3232DZER100M11; Max DC Current: 5.4A; Max Operating Temperature: 125°C; Military Standard: Not; Min Operating Temperature: -55°C; Mount: Surface Mount; Number of Pins: 2; Package Quantity: 500; Packaging: Tape and Reel; Pricing 1: 1=1.65, 10=1.53, 100=0.738, 1000=0.738, 2500=0.738, 10000=0.738 (USD); Pricing 2: 1=1.58, 10=1.466, 25=1.3532, 50=1.1276, 100=1.0599, 250=0.94712 (USD); Radiation Hardening: No; REACH SVHC: Unknown; RMS Current (Irms): 5.4A; Saturation Current: 6.4A; Stock 1: 376; Stock 2: 12872; Supplier 1: Mouser; Supplier 2: Digi-Key; Supplier Part Number 1: 70-IHLP3232DZER100M1; Supplier Part Number 2: 541-1346-1-ND; Termination: SMD/SMT; Tolerance: 20%; Width: 8.18mm
R55 R56 = R0R_JUMPER_3/4W_1206: RES 0.0 OHM 3/4W JUMP 1206; Partnumber: HCJ1206ZT0R00; Manufacturer: Stackpole Electronics; Resistance: 0mR; Fitted: No (jumper resistor); Case/Package: 1206; Case Code (Imperial): 1206; Case Code (Metric): 3216; ComponentLink1Description: http://www.seielect.com/Catalog/SEI-HCJ.pdf?src-supplier=Avnet; ComponentLink1URL: http://www.seielect.com/Catalog/SEI-HCJ.pdf?src-supplier=Avnet; ComponentLink2Description: https://www.seielect.com/Catalog/SEI-HCJ.pdf?src-supplier=Avnet+Asia; ComponentLink2URL: https://www.seielect.com/Catalog/SEI-HCJ.pdf?src-supplier=Avnet+Asia; ComponentLink3Description: https://www.seielect.com/catalog/SEI-HCJ.pdf?src-supplier=Digi-Key; ComponentLink3URL: https://www.seielect.com/catalog/SEI-HCJ.pdf?src-supplier=Digi-Key; ComponentLink4Description: https://www.seielect.com/catalog/SEI-Packaging.pdf?src-supplier=Digi-Key; ComponentLink4URL: https://www.seielect.com/catalog/SEI-Packaging.pdf?src-supplier=Digi-Key; Features: Automotive AEC-Q200; Height: 0.026inch; Length: 0.122inch; Manufacturer Part Number: HCJ1206ZT0R00; Max Operating Temperature: 155°C; Min Operating Temperature: -55°C; Mount: Surface Mount; Number of Terminations: 2; Package Quantity: 5000; Packaging: Tape and Reel; Pricing 1: 1=0.5, 10=0.358, 25=0.2788, 50=0.236, 100=0.1859, 250=0.15732, 500=0.1287, 1000=0.1001 (USD); Radiation Hardening: No; Stock 1: 1958428; Supplier 1: Digi-Key; Supplier Part Number 1: HCJ1206ZT0R00CT-ND; Termination: Wraparound; Width: 0.061inch
R57 = R10k_1%_1/8W_0805: RES 10K OHM 1/8W 1%  0805; Partnumber: CRCW080510K0FKEA; Manufacturer: Vishay; Power Rating: 125mW; Resistance: 10kR; Temperature Coefficient: 100ppm/°C; Voltage Rating (DC): 150V; NCM: 8533.21.20; Case/Package: 0805; Case Code (Imperial): 0805; Case Code (Metric): 2012; ComponentLink1Description: http://www.mouser.com/ds/2/427/dcrcwe3-109170.pdf?src-supplier=Mouser; ComponentLink1URL: http://www.mouser.com/ds/2/427/dcrcwe3-109170.pdf?src-supplier=Mouser; ComponentLink2Description: http://uk.rs-online.com/webdocs/0d98/0900766b80d98b26.pdf?src-supplier=RSComponents; ComponentLink2URL: http://uk.rs-online.com/webdocs/0d98/0900766b80d98b26.pdf?src-supplier=RSComponents; ComponentLink3Description: http://www.alliedelec.com/m/d/0c934d6939ccefa68dbe0b96d821c8cf.pdf?src-supplier=Allied+Electronics; ComponentLink3URL: http://www.alliedelec.com/m/d/0c934d6939ccefa68dbe0b96d821c8cf.pdf?src-supplier=Allied+Electronics; ComponentLink4Description: http://www.vishay.com/docs/20035/dcrcwe3.pdf?src-supplier=Avnet+Asia; ComponentLink4URL: http://www.vishay.com/docs/20035/dcrcwe3.pdf?src-supplier=Avnet+Asia; ComponentLink5Description: http://www.vishay.com/docs/20035/dcrcwe3.pdf?src-supplier=Avnet+Europe; ComponentLink5URL: http://www.vishay.com/docs/20035/dcrcwe3.pdf?src-supplier=Avnet+Europe; ComponentLink6Description: http://www.farnell.com/datasheets/2310790.pdf?src-supplier=Element14; ComponentLink6URL: http://www.farnell.com/datasheets/2310790.pdf?src-supplier=Element14; ComponentLink7Description: http://www.vishay.com/docs/20035/dcrcwe3.pdf?src-supplier=Avnet; ComponentLink7URL: http://www.vishay.com/docs/20035/dcrcwe3.pdf?src-supplier=Avnet; ComponentLink8Description: http://www.vishay.com/docs/20035/dcrcwe3.pdf?src-supplier=Future+Electronics; ComponentLink8URL: http://www.vishay.com/docs/20035/dcrcwe3.pdf?src-supplier=Future+Electronics; Composition: Thick Film; Contact Plating: Tin; Depth: 1.25mm; Height: 0.45mm; Lead Free: Lead Free; Length: 2mm; Manufacturer Part Number: CRCW080510K0FKEA; Max Operating Temperature: 155°C; Military Standard: Not; Min Operating Temperature: -55°C; Package Quantity: 5000; Packaging: Tape and Reel; Pricing 1: 1=0.1, 10=0.062, 100=0.025, 1000=0.01, 5000=0.007, 10000=0.006 (USD); Pricing 2: 1=0.1, 10=0.062, 100=0.0254, 1000=0.01142, 2500=0.00991 (USD); Radiation Hardening: No; REACH SVHC: Unknown; Stock 1: 1328419; Stock 2: 975000; Supplier 1: Mouser; Supplier 2: Digi-Key; Supplier Part Number 1: 71-CRCW0805-10K-E3; Supplier Part Number 2: 541-10.0KCDKR-ND; Termination: SMD/SMT; Tolerance: 1%; Voltage Rating: 150V; Weight: 0.000194oz; Width: 1.25mm
R58 = R1.0k_1%_1/8W_0603: RES 1.0K OHM 1/8W 1% 0603; Partnumber: MCT06030C1001FP500; Manufacturer: Vishay; Max Power Dissipation: 125mW; Power Rating: 100mW; Resistance: 1kR; Temperature Coefficient: 50ppm/°C; Voltage Rating (DC): 75V; NCM: 8533.21.20; Case/Package: 0603; Case Code (Imperial): 0603; Case Code (Metric): 1608; ComponentLink1Description: http://www.vishay.com/docs/28705/mcx0x0xpro.pdf?src-supplier=Digi-Key; ComponentLink1URL: http://www.vishay.com/docs/28705/mcx0x0xpro.pdf?src-supplier=Digi-Key; ComponentLink2Description: http://www.vishay.com/docs/28705/mc_pro.pdf?src-supplier=Avnet+Europe; ComponentLink2URL: http://www.vishay.com/docs/28705/mc_pro.pdf?src-supplier=Avnet+Europe; ComponentLink3Description: http://www.vishay.com/docs/28705/mc_pro.pdf?src-supplier=Avnet; ComponentLink3URL: http://www.vishay.com/docs/28705/mc_pro.pdf?src-supplier=Avnet; ComponentLink4Description: http://www.vishay.com/docs/28705/mc_pro.pdf?src-supplier=Future+Electronics; ComponentLink4URL: http://www.vishay.com/docs/28705/mc_pro.pdf?src-supplier=Future+Electronics; Composition: Thin Film; Contact Plating: Tin; Depth: 0.85mm; Height: 0.022inch; Lead Free: Lead Free; Length: 1.55mm; Manufacturer Part Number: MCT06030C1001FP500; Max Operating Temperature: 125°C; Military Standard: Not; Min Operating Temperature: -55°C; Mount: Surface Mount; Number of Terminations: 2; Package Quantity: 1; Packaging: Tape and Reel; Pricing 1: 1=0.1, 1000=0.025, 2000=0.023, 5000=0.019, 10000=0.018, 20000=0.017 (USD); Pricing 2: 1=0.17, 10=0.145, 100=0.0568, 1000=0.02376, 2500=0.02178 (USD); Radiation Hardening: No; REACH SVHC: Unknown; Stock 1: 142157; Stock 2: 268907; Supplier 1: Mouser; Supplier 2: Digi-Key; Supplier Part Number 1: 594-MCT06030C1001FP5; Supplier Part Number 2: MCT0603-1.00K-CFCT-ND; Termination: SMD/SMT; Tolerance: 1%; Voltage Rating: 75V; Weight: 7.1E-05oz; Width: 0.033inch
R59 = R3.24k_1%_1/8W_0805: RES 3.24k OHM 1/8W 1% 0805 SMD; Partnumber: CRCW08053K24FKEA; Manufacturer: Vishay; Max Power Dissipation: 125mW; Resistance: 3.24kR; Temperature Coefficient: 100ppm/°C; Voltage Rating (DC): 150V; NCM: 8533.21.20; Case/Package: 0805; Case Code (Imperial): 0805; Case Code (Metric): 2012; ComponentLink1Description: http://www.vishay.com/docs/20035/dcrcwe3.pdf?src-supplier=Avnet; ComponentLink1URL: http://www.vishay.com/docs/20035/dcrcwe3.pdf?src-supplier=Avnet; ComponentLink2Description: http://www.vishay.com/docs/20035/dcrcwe3.pdf?src-supplier=Digi-Key; ComponentLink2URL: http://www.vishay.com/docs/20035/dcrcwe3.pdf?src-supplier=Digi-Key; ComponentLink3Description: https://www.alliedelec.com/m/d/0c934d6939ccefa68dbe0b96d821c8cf.pdf?src-supplier=Allied+Electronics; ComponentLink3URL: https://www.alliedelec.com/m/d/0c934d6939ccefa68dbe0b96d821c8cf.pdf?src-supplier=Allied+Electronics; ComponentLink4Description: http://www.farnell.com/datasheets/2111203.pdf?src-supplier=Element14; ComponentLink4URL: http://www.farnell.com/datasheets/2111203.pdf?src-supplier=Element14; ComponentLink5Description: http://www.farnell.com/datasheets/2049244.pdf?src-supplier=Element14; ComponentLink5URL: http://www.farnell.com/datasheets/2049244.pdf?src-supplier=Element14; Composition: Thick Film; Contact Plating: Tin; Depth: 1.25mm; Features: Automotive AEC-Q200; Height: 0.02inch; Lead Free: Lead Free; Length: 2mm; Manufacturer Part Number: CRCW08053K24FKEA; Max Operating Temperature: 155°C; Military Standard: Not; Min Operating Temperature: -55°C; Number of Pins: 2; Number of Terminations: 2; Package Quantity: 10; Packaging: Tape and Reel; Power Rating: 125mW; Pricing 1: 1=0.1, 10=0.062, 100=0.025, 1000=0.01, 5000=0.007, 10000=0.006 (USD); Pricing 2: 1=0.1, 10=0.062, 100=0.0254, 1000=0.01142, 2500=0.00991 (USD); Radiation Hardening: No; REACH SVHC: Unknown; Stock 1: 17870; Stock 2: 7978; Supplier 1: Mouser; Supplier 2: Digi-Key; Supplier Part Number 1: 71-CRCW0805-3.24K-E3; Supplier Part Number 2: 541-3.24KCCT-ND; Termination: Solder; Tolerance: 1%; Voltage Rating: 150V; Weight: 0.000194oz; Width: 1.25mm
U10 = TPS5430QDDARQ1: Manufacturer: Texas Instruments; Efficiency: 95%; Max Input Voltage: 36V; Max Output Current: 3A; Max Output Voltage: 31V; Min Input Voltage: 5.5V; Min Output Voltage: 1.22V; Number of Outputs: 1; Output Type: Adjustable; Quiescent Current: 3mA; Switching Frequency: 500kHz; Synchronous Rectifier: No; Partnumber: TPS5430QDDARQ1; ComponentLink1Description: http://www.ti.com/general/docs/lit/getliterature.tsp?genericPartNumber=TPS5430-Q1&&fileType=pdf&src-supplier=Avnet; ComponentLink1URL: http://www.ti.com/general/docs/lit/getliterature.tsp?genericPartNumber=TPS5430-Q1&&fileType=pdf&src-supplier=Avnet; ComponentLink2Description: http://focus.ti.com/lit/ds/symlink/tps5430-q1.pdf?src-supplier=Avnet+Europe; ComponentLink2URL: http://focus.ti.com/lit/ds/symlink/tps5430-q1.pdf?src-supplier=Avnet+Europe; ComponentLink3Description: http://www.ti.com/lit/ds/symlink/tps5430-q1.pdf?src-supplier=Digi-Key; ComponentLink3URL: http://www.ti.com/lit/ds/symlink/tps5430-q1.pdf?src-supplier=Digi-Key; ComponentLink4Description: http://www.farnell.com/datasheets/2019094.pdf?src-supplier=Element14; ComponentLink4URL: http://www.farnell.com/datasheets/2019094.pdf?src-supplier=Element14; ComponentLink5Description: http://www.ti.com/lit/gpn/tps5430-q1?src-supplier=Mouser; ComponentLink5URL: http://www.ti.com/lit/gpn/tps5430-q1?src-supplier=Mouser; ComponentLink6Description: http://datasheet.iiic.cc/texas_instruments/TPS5430QDDARQ1.pdf?src-supplier=IIIC; ComponentLink6URL: http://datasheet.iiic.cc/texas_instruments/TPS5430QDDARQ1.pdf?src-supplier=IIIC; Lead Free: Lead Free; Manufacturer Part Number: TPS5430QDDARQ1; Max Operating Temperature: 125°C; Min Operating Temperature: -40°C; Mount: Surface Mount; Number of Pins: 8; Operating Supply Voltage: 36V; Output Current: 3A; Output Voltage: 31V; Package Quantity: 2500; Packaging: Tape and Reel; Pricing 1: 1=4.82, 10=4.32, 25=4.09, 100=3.36, 250=3.02, 500=2.91 (USD); Pricing 2: 1=4.81, 10=4.32, 25=4.0836, 100=3.3578, 250=3.01292, 500=2.904, 1000=2.41395 (USD); Radiation Hardening: No; REACH SVHC: No SVHC; Stock 1: 2625; Stock 2: 2162; Supplier 1: Mouser; Supplier 2: Digi-Key; Supplier Part Number 1: 595-TPS5430QDDARQ1; Supplier Part Number 2: 296-23177-1-ND; Weight: 0.00249oz

## Sheet 5_dc_dc_3V3_EPS_Beacon.SchDoc: EPS/BCM Step-Down Converter
size A4; DrawnBy: Sara V. Martínez; Engineer: Flight; DocumentNumber: 8; Revision: V0.1; SheetNumber: 8; SheetTotal: 11
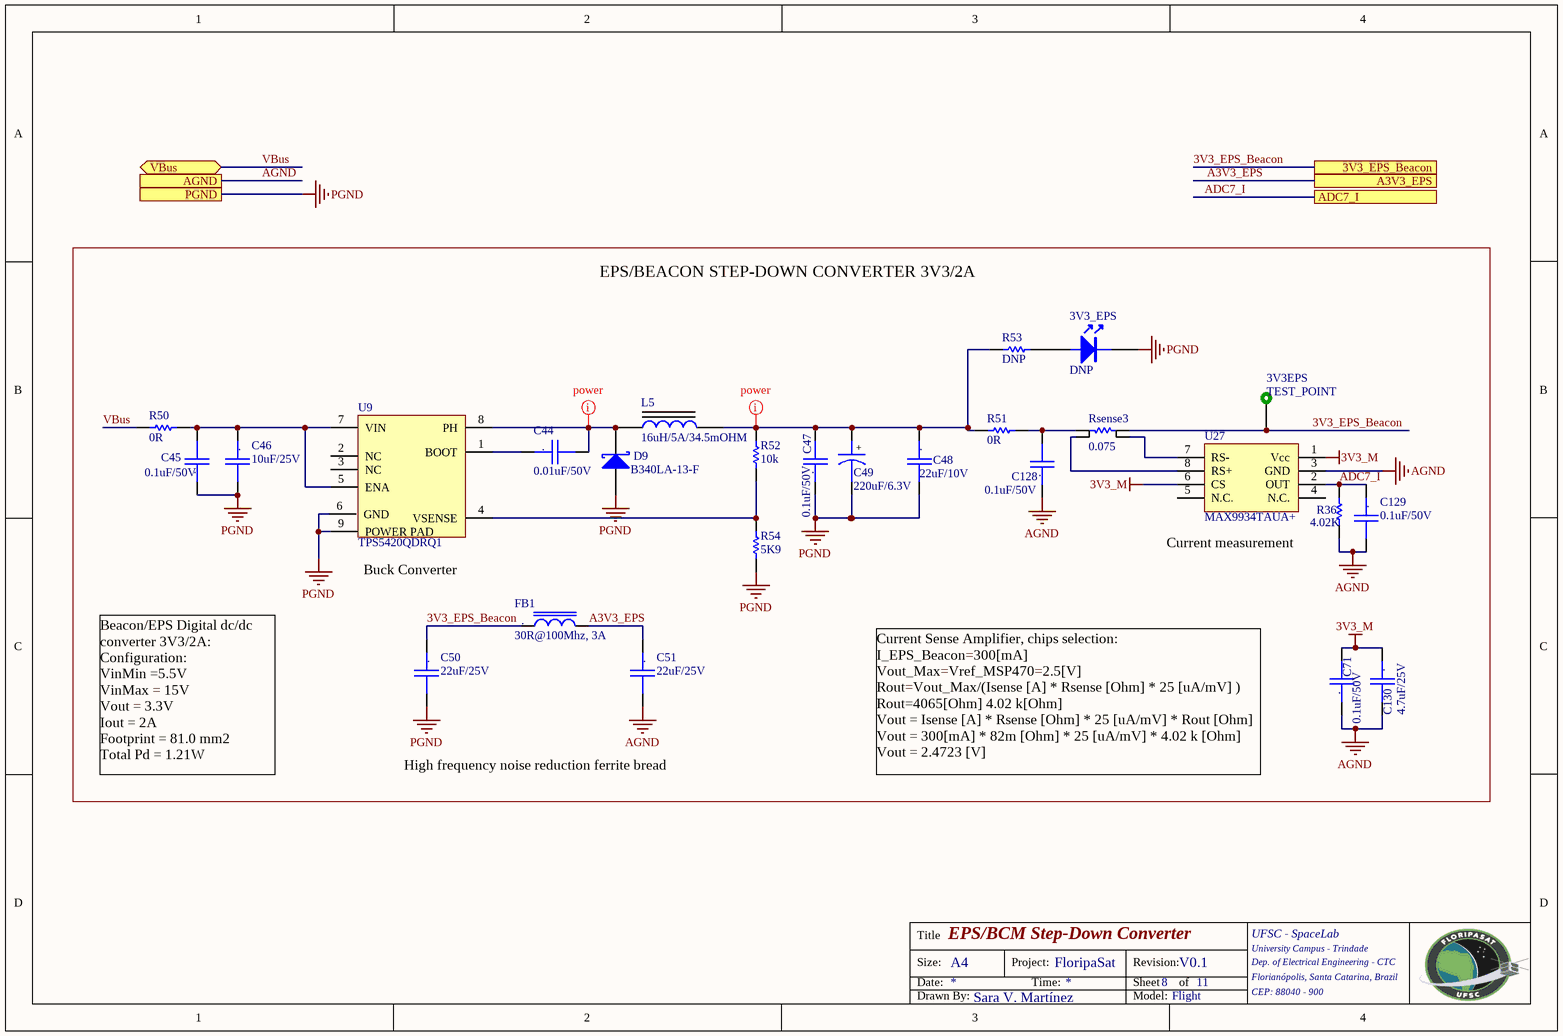
[diagram p6: 5_dc_dc_3V3_EPS_Beacon.SchDoc]

### Parts
3V3_EPS  DNP  [0603-LED]
3V3EPS  TEST_POINT  [TEST_POINT]  (no BOM)
C44  0.01uF/50V  [CC0805]
C45  0.1uF/50V  [CC0805]
C46  10uF/25V  [CC1206]
C47  0.1uF/50V  [CC0805]
C48  22uF/10V  [CC1206]
C49  220uF/6.3V  [cc1210]
C50  22uF/25V  [CC1210]
C51  22uF/25V  [CC1210]
C71  0.1uF/50V  [CC0603]
C128  0.1uF/50V  [CC0603]
C129  0.1uF/50V  [CC0603]
C130  4.7uF/25V  [CC0805]
D9  B340LA-13-F  [DO-214AC]
FB1  30R@100Mhz, 3A  [IND0805]
L5  16uH/5A/34.5mOHM  [IND_744325xxx]
R36  4.02K  [0805]
R50  0R  [1206]
R51  0R  [1206]
R52  10k  [0805]
R53  DNP  [0603]
R54  5K9  [0805]
Rsense3  0.075  [1206 - ohmite]
U9  TPS5420QDRQ1  [SO8 Power PAD]
U27  MAX9934TAUA+  [MSOP-8]

### Ports
3V3_EPS_Beacon, A3V3_EPS, ADC7_I, AGND, PGND, VBus (bidir)

### Nets
3V3_EPS_Beacon: 3V3EPS.1 C50.1 FB1.1 Rsense3.2 ; port 3V3_EPS_Beacon
3V3_M: C71.2 C130.1 U27.1(Vcc) U27.6(CS)
A3V3_EPS: C51.1 FB1.2 ; port A3V3_EPS
AGND: C51.2 C71.1 C128.1 C129.2 C130.2 R36.1 U27.3(GND) ; port AGND
PGND: 3V3_EPS.2(K) C45.1 C46.2 C47.1 C48.2 C49.2 C50.2 D9.2(A) R54.1 U9.6(GND) U9.9(POWER_PAD) ; port PGND
ADC7_I: C129.1 R36.2 U27.2(OUT) ; port ADC7_I
VBus: R50.2 ; port VBus
Net3V3_EPS_1: 3V3_EPS.1(A) R53.1
NetC44_1: C44.1 U9.1(BOOT)
NetC44_2: C44.2 D9.1(K) L5.1 U9.8(PH)
NetC45_2: C45.2 C46.1 R50.1 U9.5(ENA) U9.7(VIN)
NetC47_2: C47.2 C48.1 C49.1 L5.2 R51.2 R52.2 R53.2
NetC128_2: C128.2 R51.1 Rsense3.1
NetR52_1: R52.1 R54.2 U9.4(VSENSE)
NetRsense3_3: Rsense3.3 U27.8(RS+)
NetRsense3_4: Rsense3.4 U27.7(RS-)

Not connected (* = marked no-connect by the designer): U9 2(NC) 3(NC); U27 4(N.C.) 5(N.C.)

### Layout directives
net class power: NetC44_2, NetC47_2

### Notes on the sheet
- EPS/BEACON STEP-DOWN CONVERTER 3V3/2A
- (near U9) Buck Converter
- Current measurement
- Beacon/EPS Digital dc/dc converter 3V3/2A:
  Configuration:
  VinMin =5.5V
  VinMax = 15V
  Vout = 3.3V
  Iout = 2A
  Footprint = 81.0 mm2
  Total Pd = 1.21W
- High frequency noise reduction ferrite bread
- Current Sense Amplifier, chips selection:
  I_EPS_Beacon=300[mA]
  Vout_Max=Vref_MSP470=2.5[V]
  Rout=Vout_Max/(Isense [A] * Rsense [Ohm] * 25 [uA/mV] )
  Rout=4065[Ohm] 4.02 k[Ohm]
  Vout = Isense [A] * Rsense [Ohm] * 25 [uA/mV] * Rout [Ohm]
  Vout = 300[mA] * 82m [Ohm] * 25 [uA/mV] * 4.02 k [Ohm]
  Vout = 2.4723 [V]
- Title
- Size:
- Date:
- A4
- Project:
- Time:
- FloripaSat
- Revision:
- Sheet
- of
- UFSC - SpaceLab
- University Campus - Trindade
- Dep. of Electrical Engineering - CTC
- Florianópolis, Santa Catarina, Brazil
- Drawn By:
- Model:
- CEP: 88040 - 900
- (in symbol Cap_Cer_X7R_0.01uF_16V_1210) .
- (in symbol Cap_Cer_X7R_0.1uF_25V_0805) .
- (in symbol Cap_Cer_X7R_0.1uF_50V_0603) .
- (in symbol Cap_Cer_X7R_0.01uF_50V_0805) .
- (in symbol Cap_Cer_X7R_4.7uF_25V_0805) .
- (in symbol Cap_Cer_X7R_10uF_25V_1206) .
- (in symbol Cap_Cer_X7R_22uF_10V_1206) .
- (in symbol Cap_Tant_SMD_220uF_6.3V_1210) +
- (in symbol FB_30R_3A_100MHz_0805) .

### Library data of the parts
3V3_EPS = LED/G_0603: SMD Green LED; Partnumber: 150060VS75000; NCM: 8541.40.21
3V3EPS = TEST_POINT: Test point
C44 = Cap_Cer_X7R_0.01uF_50V_0805: CAP CER 0.01uF 50V 10% X7R 0805; Partnumber: GRM216R71H103KA01D; NCM: 8532.24.10
C45 C47 = Cap_Cer_X7R_0.1uF_25V_0805: CAP CER 0.1UF 50V 10% X7R 0805; Partnumber: GRM216R71H103KA01D; NCM: 8532.24.10
C46 = Cap_Cer_X7R_10uF_25V_1206: CAP CER 10uF 25V 10% X7R 1206; Partnumber: GRM31CR71E106KA12L; NCM: 8532.24.10
C48 = Cap_Cer_X7R_22uF_10V_1206: CAP CER 22uF 10V 10% X7R 1206; Partnumber: GRM31CR71A226KE15L; NCM: 8532.24.10
C49 = Cap_Tant_SMD_220uF_6.3V_1210: CAP Tantalum 220uF 6.3V 20% 1210; Partnumber: 6TPE220MAZB; NCM: 8532.21.11
C50 C51 = Cap_Cer_X7R_0.01uF_16V_1210: CAP CER 22uF 25V 10% X7R 1210; Partnumber: GRM32ER71E226KE15L; NCM: 8532.24.10
C71 C128 C129 = Cap_Cer_X7R_0.1uF_50V_0603: CAP CER 0.1UF 50V 10% X7R 0603; Partnumber: GRM188R71H104KA93D; NCM: 8532.24.10
C130 = Cap_Cer_X7R_4.7uF_25V_0805: CAP CER 4.7uF 25V 10% X7R 0805; Partnumber: GRM21BR71E475KA73L; NCM: 8532.24.10
D9 = DIODE_SCHOTTKY_40V_3A_B340LA-13-F: DIODE SCHOTTKY 40V 3A B340LA-13-F; NCM: 8541.10.29; Partnumber: B340LA-13-F
FB1 = FB_30R_3A_100MHz_0805: Ferrite Bead 30 OHM 3A 100MHz; Partnumber: BLM21PG300SN1D; NCM: 8504.50.00
L5 = IND_POWER_16uH_5A_35.5mR: INDUCTOR 16UH 5A SMD; Partnumber: 7443251600; NCM: 8504.50.00
R36 = R3.3k_0.1%_1/10W_0805: RES 3k3 OHM 1/10W 0.1% 0805; Partnumber: CPF0805B3K3E1; NCM: 8533.21.20
R50 R51 = R0R_JUMPER_1/2W_1206: RES 0.0 OHM 1/2W JUMP 1206; Partnumber: CRCW12060000Z0EAHP; NCM: 8533.21.20
R52 = R10k_1%_1/8W_0805: RES 10K OHM 1/8W 1%  0805; Partnumber: CRCW080510K0FKEA; NCM: 8533.21.20
R53 = R1.0k_1%_1/8W_0603: as R60 on sheet 3_MCU_EPS; NCM: 8533.21.20
R54 = R5.9K_1%_1/8W_0805: RES 5K9 OHM 1/8W 1% 0805; Partnumber: 71-CRCW0805-5.9K-E3; NCM: 8533.21.20
Rsense3 = R0.05R_0.5%_0.5W_1206: Current Sense Resistors - SMD 0.05ohm .5% 4 Terminal; Partnumber: LVK12R050DER; NCM: 8533.21.20
U9 = TPS5420QDRQ1: Partnumber: TPS5420QDRQ1
U27 = MAX9934TAUA+: Partnumber: MAX9934TAUA+